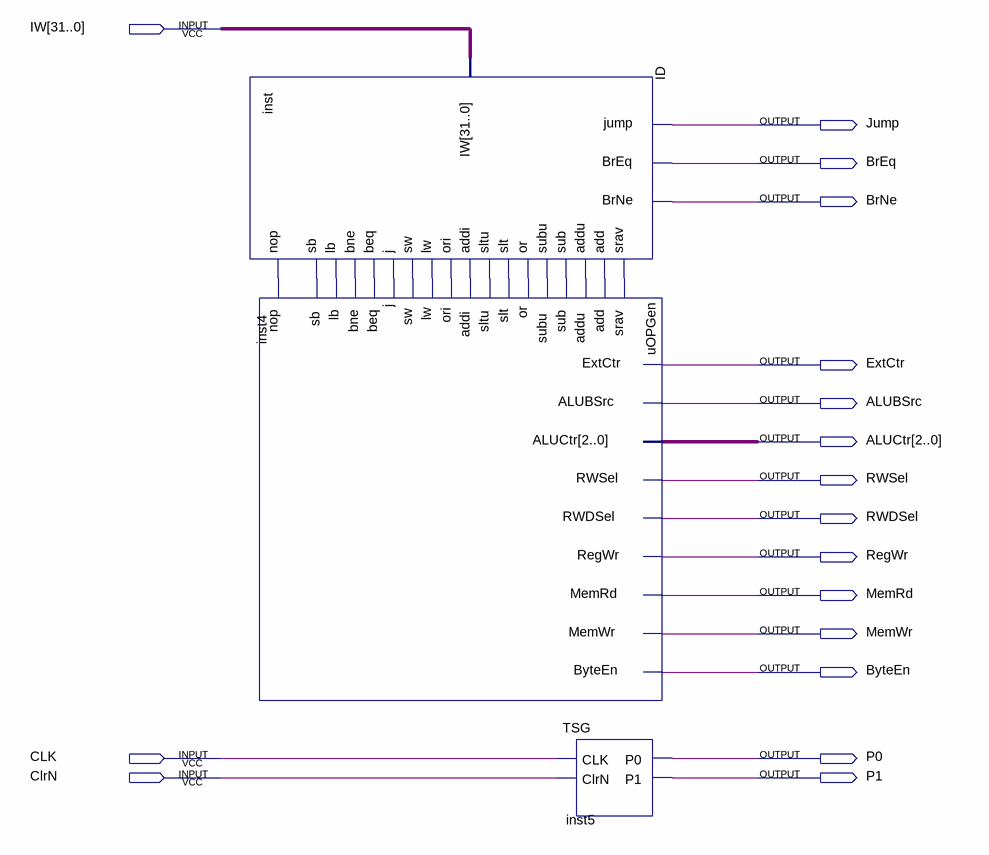
[diagram p0: schematic sheet]
// Quartus schematic CU.bdf as structural Verilog: 3 symbols, 17 pins
module CU (
  input  [31:0] IW,
  input  CLK,
  input  ClrN,
  output Jump,
  output BrEq,
  output BrNe,
  output ExtCtr,
  output ALUBSrc,
  output [2:0] ALUCtr,
  output RWSel,
  output RWDSel,
  output RegWr,
  output MemRd,
  output MemWr,
  output ByteEn,
  output P0,
  output P1
);

  wire inst_add, inst_addi, inst_addu, inst_beq, inst_bne, inst_j, inst_lb, inst_lw, inst_nop, inst_or,
       inst_ori, inst_sb, inst_slt, inst_sltu, inst_srav, inst_sub, inst_subu, inst_sw;

  ID inst (
    .IW(IW), .jump(Jump), .BrEq(BrEq), .BrNe(BrNe), .srav(inst_srav), .add(inst_add), .addu(inst_addu),
    .sub(inst_sub), .subu(inst_subu), .\or (inst_or), .slt(inst_slt), .sltu(inst_sltu), .j(inst_j),
    .beq(inst_beq), .bne(inst_bne), .addi(inst_addi), .ori(inst_ori), .lb(inst_lb), .lw(inst_lw),
    .sb(inst_sb), .sw(inst_sw), .nop(inst_nop));
  uOPGen inst4 (
    .srav(inst_srav), .add(inst_add), .addu(inst_addu), .sub(inst_sub), .subu(inst_subu), .\or (inst_or),
    .sltu(inst_sltu), .j(inst_j), .beq(inst_beq), .bne(inst_bne), .addi(inst_addi), .ori(inst_ori),
    .lw(inst_lw), .sw(inst_sw), .slt(inst_slt), .nop(inst_nop), .sb(inst_sb), .lb(inst_lb), .ExtCtr(ExtCtr),
    .RWSel(RWSel), .ALUBSrc(ALUBSrc), .RWDSel(RWDSel), .RegWr(RegWr), .MemRd(MemRd), .ALUCtr(ALUCtr),
    .MemWr(MemWr), .ByteEn(ByteEn));
  TSG inst5 (.CLK(CLK), .ClrN(ClrN), .P0(P0), .P1(P1));
endmodule
